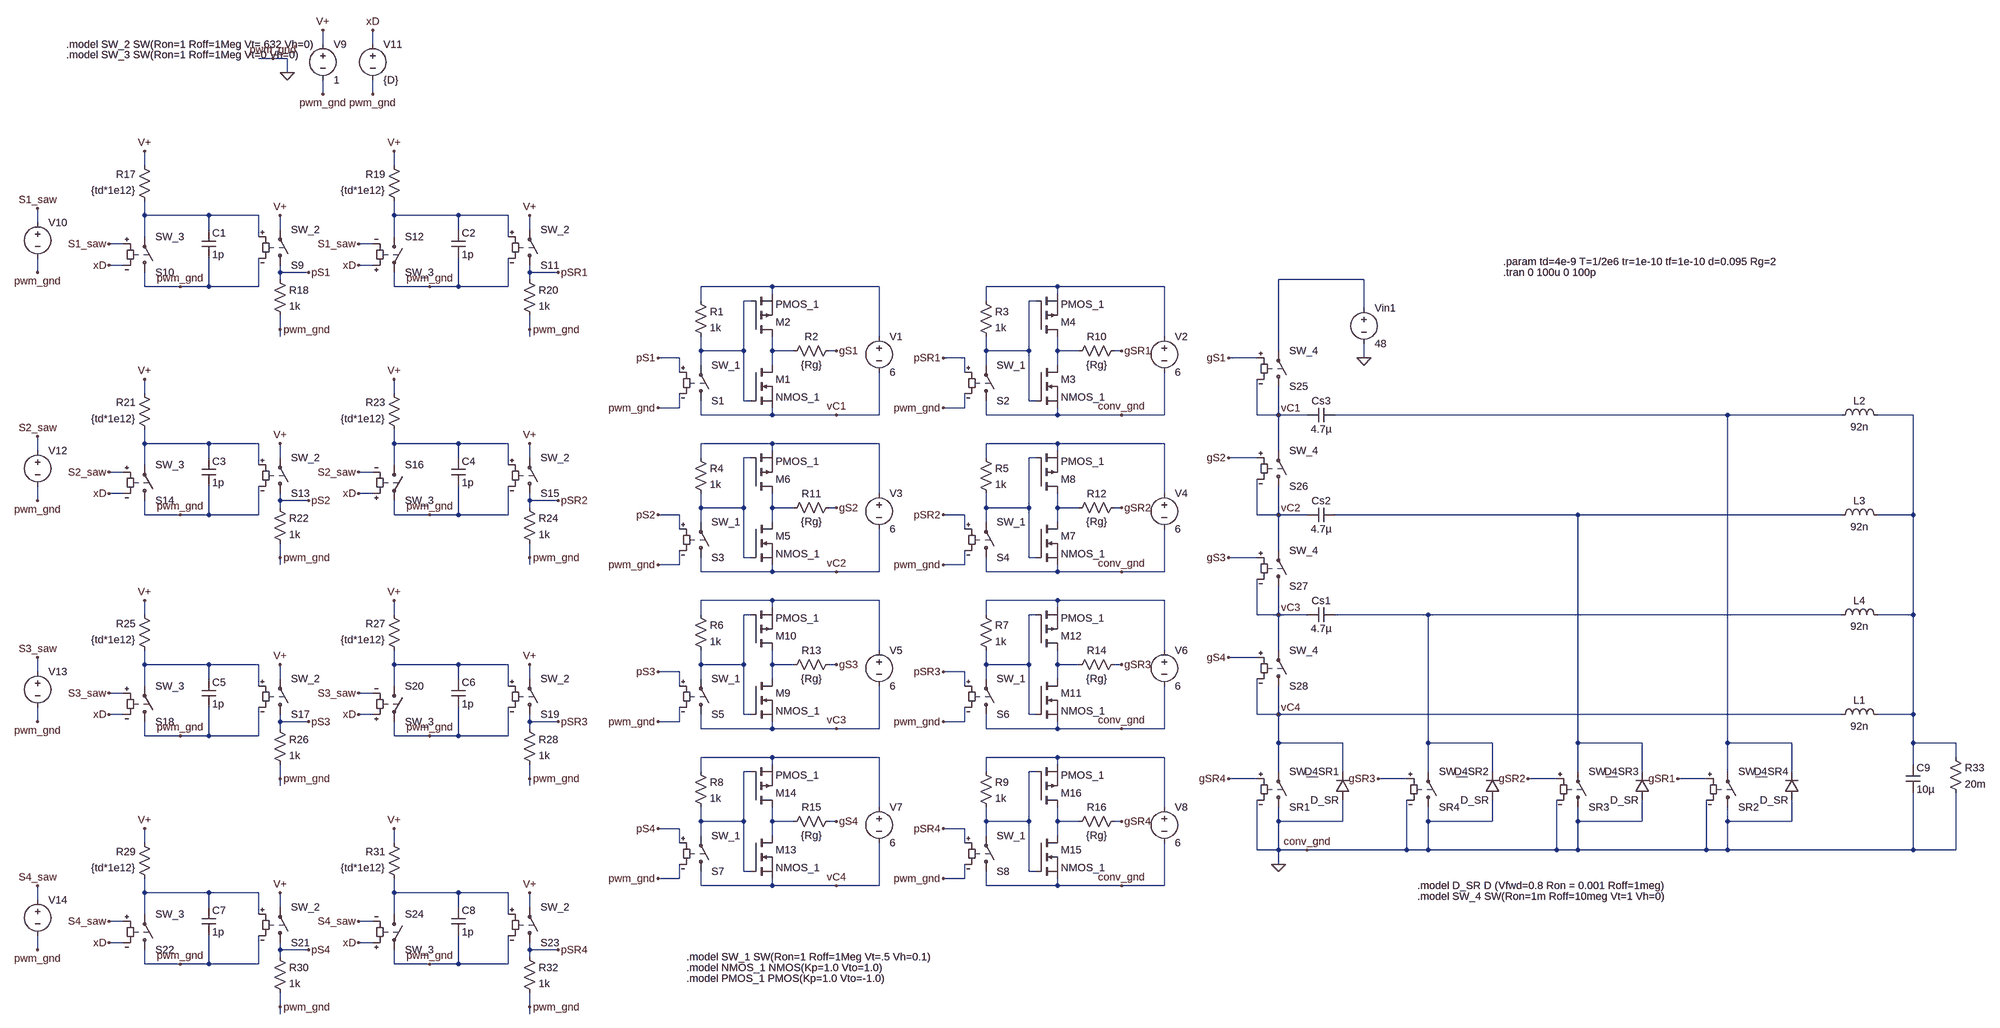
[diagram p0: schematic Draft5.asc]
Draft5.asc, the LTspice schematic file:
Version 4
SHEET 1 3272 1412
WIRE -448 -816 -448 -848
WIRE -336 -816 -336 -848
WIRE -560 -784 -592 -784
WIRE -528 -784 -560 -784
WIRE -528 -752 -528 -784
WIRE -448 -704 -448 -736
WIRE -336 -704 -336 -736
WIRE -848 -544 -848 -576
WIRE -288 -544 -288 -576
WIRE -848 -432 -848 -464
WIRE -704 -432 -848 -432
WIRE -592 -432 -704 -432
WIRE -288 -432 -288 -464
WIRE -144 -432 -288 -432
WIRE -32 -432 -144 -432
WIRE -1088 -416 -1088 -448
WIRE -704 -400 -704 -432
WIRE -544 -400 -544 -432
WIRE -144 -400 -144 -432
WIRE 16 -400 16 -432
WIRE -848 -384 -848 -432
WIRE -592 -384 -592 -432
WIRE -288 -384 -288 -432
WIRE -32 -384 -32 -432
WIRE -896 -368 -928 -368
WIRE -336 -368 -368 -368
WIRE -896 -320 -928 -320
WIRE -336 -320 -368 -320
WIRE -1088 -304 -1088 -336
WIRE -544 -304 -544 -320
WIRE -480 -304 -544 -304
WIRE 16 -304 16 -320
WIRE 80 -304 16 -304
WIRE -544 -288 -544 -304
WIRE 16 -288 16 -304
WIRE 1888 -288 1696 -288
WIRE -848 -272 -848 -304
WIRE -768 -272 -848 -272
WIRE -704 -272 -704 -336
WIRE -704 -272 -768 -272
WIRE -592 -272 -592 -336
WIRE -592 -272 -704 -272
WIRE -288 -272 -288 -304
WIRE -208 -272 -288 -272
WIRE -144 -272 -144 -336
WIRE -144 -272 -208 -272
WIRE -32 -272 -32 -336
WIRE -32 -272 -144 -272
WIRE 560 -272 400 -272
WIRE 800 -272 560 -272
WIRE 1200 -272 1040 -272
WIRE 1440 -272 1200 -272
WIRE 560 -256 560 -272
WIRE 1200 -256 1200 -272
WIRE 400 -240 400 -272
WIRE 512 -240 496 -240
WIRE 1040 -240 1040 -272
WIRE 1152 -240 1136 -240
WIRE 1888 -224 1888 -288
WIRE -544 -176 -544 -208
WIRE 16 -176 16 -208
WIRE -544 -160 -544 -176
WIRE 16 -160 16 -176
WIRE 800 -160 800 -272
WIRE 1440 -160 1440 -272
WIRE 400 -128 400 -160
WIRE 496 -128 496 -240
WIRE 496 -128 400 -128
WIRE 560 -128 560 -160
WIRE 608 -128 560 -128
WIRE 704 -128 688 -128
WIRE 1040 -128 1040 -160
WIRE 1136 -128 1136 -240
WIRE 1136 -128 1040 -128
WIRE 1200 -128 1200 -160
WIRE 1248 -128 1200 -128
WIRE 1344 -128 1328 -128
WIRE 1696 -128 1696 -288
WIRE 352 -112 304 -112
WIRE 992 -112 944 -112
WIRE 1648 -112 1584 -112
WIRE 1888 -112 1888 -144
WIRE 400 -96 400 -128
WIRE 560 -96 560 -128
WIRE 1040 -96 1040 -128
WIRE 1200 -96 1200 -128
WIRE 352 -80 352 -112
WIRE 992 -80 992 -112
WIRE -848 -32 -848 -64
WIRE -288 -32 -288 -64
WIRE 496 -16 496 -128
WIRE 512 -16 496 -16
WIRE 1136 -16 1136 -128
WIRE 1152 -16 1136 -16
WIRE 352 0 352 -32
WIRE 352 0 304 0
WIRE 992 0 992 -32
WIRE 992 0 944 0
WIRE 400 16 400 -16
WIRE 560 16 560 0
WIRE 560 16 400 16
WIRE 704 16 560 16
WIRE 800 16 800 -80
WIRE 800 16 704 16
WIRE 1040 16 1040 -16
WIRE 1200 16 1200 0
WIRE 1200 16 1040 16
WIRE 1344 16 1200 16
WIRE 1440 16 1440 -80
WIRE 1440 16 1344 16
WIRE 1648 16 1648 -64
WIRE 1696 16 1696 -48
WIRE 1696 16 1648 16
WIRE 1760 16 1696 16
WIRE 2704 16 1824 16
WIRE 2960 16 2704 16
WIRE 3120 16 3040 16
WIRE -848 80 -848 48
WIRE -704 80 -848 80
WIRE -592 80 -704 80
WIRE -288 80 -288 48
WIRE -144 80 -288 80
WIRE -32 80 -144 80
WIRE 560 80 400 80
WIRE 800 80 560 80
WIRE 1200 80 1040 80
WIRE 1440 80 1200 80
WIRE -1088 96 -1088 64
WIRE 560 96 560 80
WIRE 1200 96 1200 80
WIRE 1696 96 1696 16
WIRE -704 112 -704 80
WIRE -544 112 -544 80
WIRE -144 112 -144 80
WIRE 16 112 16 80
WIRE 400 112 400 80
WIRE 512 112 496 112
WIRE 1040 112 1040 80
WIRE 1152 112 1136 112
WIRE 1648 112 1584 112
WIRE -848 128 -848 80
WIRE -592 128 -592 80
WIRE -288 128 -288 80
WIRE -32 128 -32 80
WIRE -896 144 -928 144
WIRE -336 144 -368 144
WIRE -896 192 -928 192
WIRE -336 192 -368 192
WIRE 800 192 800 80
WIRE 1440 192 1440 80
WIRE -1088 208 -1088 176
WIRE -544 208 -544 192
WIRE -480 208 -544 208
WIRE 16 208 16 192
WIRE 80 208 16 208
WIRE -544 224 -544 208
WIRE 16 224 16 208
WIRE 400 224 400 192
WIRE 496 224 496 112
WIRE 496 224 400 224
WIRE 560 224 560 192
WIRE 608 224 560 224
WIRE 704 224 688 224
WIRE 1040 224 1040 192
WIRE 1136 224 1136 112
WIRE 1136 224 1040 224
WIRE 1200 224 1200 192
WIRE 1248 224 1200 224
WIRE 1344 224 1328 224
WIRE -848 240 -848 208
WIRE -768 240 -848 240
WIRE -704 240 -704 176
WIRE -704 240 -768 240
WIRE -592 240 -592 176
WIRE -592 240 -704 240
WIRE -288 240 -288 208
WIRE -208 240 -288 240
WIRE -144 240 -144 176
WIRE -144 240 -208 240
WIRE -32 240 -32 176
WIRE -32 240 -144 240
WIRE 352 240 304 240
WIRE 992 240 944 240
WIRE 1648 240 1648 160
WIRE 1696 240 1696 176
WIRE 1696 240 1648 240
WIRE 1760 240 1696 240
WIRE 2368 240 1824 240
WIRE 2960 240 2368 240
WIRE 3120 240 3120 16
WIRE 3120 240 3040 240
WIRE 400 256 400 224
WIRE 560 256 560 224
WIRE 1040 256 1040 224
WIRE 1200 256 1200 224
WIRE 352 272 352 240
WIRE 992 272 992 240
WIRE 1696 320 1696 240
WIRE -544 336 -544 304
WIRE 16 336 16 304
WIRE 496 336 496 224
WIRE 512 336 496 336
WIRE 1136 336 1136 224
WIRE 1152 336 1136 336
WIRE 1648 336 1584 336
WIRE -544 352 -544 336
WIRE 16 352 16 336
WIRE 352 352 352 320
WIRE 352 352 304 352
WIRE 992 352 992 320
WIRE 992 352 944 352
WIRE 400 368 400 336
WIRE 560 368 560 352
WIRE 560 368 400 368
WIRE 704 368 560 368
WIRE 800 368 800 272
WIRE 800 368 704 368
WIRE 1040 368 1040 336
WIRE 1200 368 1200 352
WIRE 1200 368 1040 368
WIRE 1344 368 1200 368
WIRE 1440 368 1440 272
WIRE 1440 368 1344 368
WIRE 560 432 400 432
WIRE 800 432 560 432
WIRE 1200 432 1040 432
WIRE 1440 432 1200 432
WIRE 560 448 560 432
WIRE 1200 448 1200 432
WIRE -848 464 -848 432
WIRE -288 464 -288 432
WIRE 400 464 400 432
WIRE 512 464 496 464
WIRE 1040 464 1040 432
WIRE 1152 464 1136 464
WIRE 1648 464 1648 384
WIRE 1696 464 1696 400
WIRE 1696 464 1648 464
WIRE 1760 464 1696 464
WIRE 2032 464 1824 464
WIRE 2960 464 2032 464
WIRE 3120 464 3120 240
WIRE 3120 464 3040 464
WIRE 800 544 800 432
WIRE 1440 544 1440 432
WIRE 1696 544 1696 464
WIRE 1648 560 1584 560
WIRE -848 576 -848 544
WIRE -704 576 -848 576
WIRE -592 576 -704 576
WIRE -288 576 -288 544
WIRE -144 576 -288 576
WIRE -32 576 -144 576
WIRE 400 576 400 544
WIRE 496 576 496 464
WIRE 496 576 400 576
WIRE 560 576 560 544
WIRE 608 576 560 576
WIRE 704 576 688 576
WIRE 1040 576 1040 544
WIRE 1136 576 1136 464
WIRE 1136 576 1040 576
WIRE 1200 576 1200 544
WIRE 1248 576 1200 576
WIRE 1344 576 1328 576
WIRE -1088 592 -1088 560
WIRE 352 592 304 592
WIRE 992 592 944 592
WIRE -704 608 -704 576
WIRE -544 608 -544 576
WIRE -144 608 -144 576
WIRE 16 608 16 576
WIRE 400 608 400 576
WIRE 560 608 560 576
WIRE 1040 608 1040 576
WIRE 1200 608 1200 576
WIRE -848 624 -848 576
WIRE -592 624 -592 576
WIRE -288 624 -288 576
WIRE -32 624 -32 576
WIRE 352 624 352 592
WIRE 992 624 992 592
WIRE -896 640 -928 640
WIRE -336 640 -368 640
WIRE -896 688 -928 688
WIRE -336 688 -368 688
WIRE 496 688 496 576
WIRE 512 688 496 688
WIRE 1136 688 1136 576
WIRE 1152 688 1136 688
WIRE 1648 688 1648 608
WIRE 1696 688 1696 624
WIRE 1696 688 1648 688
WIRE 2960 688 1696 688
WIRE 3120 688 3120 464
WIRE 3120 688 3040 688
WIRE -1088 704 -1088 672
WIRE -544 704 -544 688
WIRE -480 704 -544 704
WIRE 16 704 16 688
WIRE 80 704 16 704
WIRE 352 704 352 672
WIRE 352 704 304 704
WIRE 992 704 992 672
WIRE 992 704 944 704
WIRE -544 720 -544 704
WIRE 16 720 16 704
WIRE 400 720 400 688
WIRE 560 720 560 704
WIRE 560 720 400 720
WIRE 704 720 560 720
WIRE 800 720 800 624
WIRE 800 720 704 720
WIRE 1040 720 1040 688
WIRE 1200 720 1200 704
WIRE 1200 720 1040 720
WIRE 1344 720 1200 720
WIRE 1440 720 1440 624
WIRE 1440 720 1344 720
WIRE -848 736 -848 704
WIRE -768 736 -848 736
WIRE -704 736 -704 672
WIRE -704 736 -768 736
WIRE -592 736 -592 672
WIRE -592 736 -704 736
WIRE -288 736 -288 704
WIRE -208 736 -288 736
WIRE -144 736 -144 672
WIRE -144 736 -208 736
WIRE -32 736 -32 672
WIRE -32 736 -144 736
WIRE 1696 752 1696 688
WIRE 1840 752 1696 752
WIRE 2032 752 2032 464
WIRE 2176 752 2032 752
WIRE 2368 752 2368 240
WIRE 2512 752 2368 752
WIRE 2704 752 2704 16
WIRE 2848 752 2704 752
WIRE 3120 752 3120 688
WIRE 3216 752 3120 752
WIRE 560 784 400 784
WIRE 800 784 560 784
WIRE 1200 784 1040 784
WIRE 1440 784 1200 784
WIRE 3216 784 3216 752
WIRE 560 800 560 784
WIRE 1200 800 1200 784
WIRE 3120 800 3120 752
WIRE 400 816 400 784
WIRE 512 816 496 816
WIRE 1040 816 1040 784
WIRE 1152 816 1136 816
WIRE 1696 816 1696 752
WIRE 1840 816 1840 752
WIRE 2032 816 2032 752
WIRE 2176 816 2176 752
WIRE 2368 816 2368 752
WIRE 2512 816 2512 752
WIRE 2704 816 2704 752
WIRE 2848 816 2848 752
WIRE -544 832 -544 800
WIRE 16 832 16 800
WIRE 1648 832 1584 832
WIRE 1984 832 1920 832
WIRE 2320 832 2256 832
WIRE 2656 832 2592 832
WIRE -544 848 -544 832
WIRE 16 848 16 832
WIRE 800 896 800 784
WIRE 1440 896 1440 784
WIRE 400 928 400 896
WIRE 496 928 496 816
WIRE 496 928 400 928
WIRE 560 928 560 896
WIRE 608 928 560 928
WIRE 704 928 688 928
WIRE 1040 928 1040 896
WIRE 1136 928 1136 816
WIRE 1136 928 1040 928
WIRE 1200 928 1200 896
WIRE 1248 928 1200 928
WIRE 1344 928 1328 928
WIRE 1696 928 1696 896
WIRE 1840 928 1840 880
WIRE 1840 928 1696 928
WIRE 2032 928 2032 896
WIRE 2176 928 2176 880
WIRE 2176 928 2032 928
WIRE 2368 928 2368 896
WIRE 2512 928 2512 880
WIRE 2512 928 2368 928
WIRE 2704 928 2704 896
WIRE 2848 928 2848 880
WIRE 2848 928 2704 928
WIRE 352 944 304 944
WIRE 992 944 944 944
WIRE 400 960 400 928
WIRE 560 960 560 928
WIRE 1040 960 1040 928
WIRE 1200 960 1200 928
WIRE -848 976 -848 944
WIRE -288 976 -288 944
WIRE 352 976 352 944
WIRE 992 976 992 944
WIRE 1648 992 1648 880
WIRE 1696 992 1696 928
WIRE 1696 992 1648 992
WIRE 1760 992 1696 992
WIRE 1984 992 1984 880
WIRE 1984 992 1760 992
WIRE 2032 992 2032 928
WIRE 2032 992 1984 992
WIRE 2320 992 2320 880
WIRE 2320 992 2032 992
WIRE 2368 992 2368 928
WIRE 2368 992 2320 992
WIRE 2656 992 2656 880
WIRE 2656 992 2368 992
WIRE 2704 992 2704 928
WIRE 2704 992 2656 992
WIRE 3120 992 3120 864
WIRE 3120 992 2704 992
WIRE 3216 992 3216 864
WIRE 3216 992 3120 992
WIRE 1696 1024 1696 992
WIRE 496 1040 496 928
WIRE 512 1040 496 1040
WIRE 1136 1040 1136 928
WIRE 1152 1040 1136 1040
WIRE 352 1056 352 1024
WIRE 352 1056 304 1056
WIRE 992 1056 992 1024
WIRE 992 1056 944 1056
WIRE 400 1072 400 1040
WIRE 560 1072 560 1056
WIRE 560 1072 400 1072
WIRE 704 1072 560 1072
WIRE 800 1072 800 976
WIRE 800 1072 704 1072
WIRE 1040 1072 1040 1040
WIRE 1200 1072 1200 1056
WIRE 1200 1072 1040 1072
WIRE 1344 1072 1200 1072
WIRE 1440 1072 1440 976
WIRE 1440 1072 1344 1072
WIRE -848 1088 -848 1056
WIRE -704 1088 -848 1088
WIRE -592 1088 -704 1088
WIRE -288 1088 -288 1056
WIRE -144 1088 -288 1088
WIRE -32 1088 -144 1088
WIRE -1088 1104 -1088 1072
WIRE -704 1120 -704 1088
WIRE -544 1120 -544 1088
WIRE -144 1120 -144 1088
WIRE 16 1120 16 1088
WIRE -848 1136 -848 1088
WIRE -592 1136 -592 1088
WIRE -288 1136 -288 1088
WIRE -32 1136 -32 1088
WIRE -896 1152 -928 1152
WIRE -336 1152 -368 1152
WIRE -896 1200 -928 1200
WIRE -336 1200 -368 1200
WIRE -1088 1216 -1088 1184
WIRE -544 1216 -544 1200
WIRE -480 1216 -544 1216
WIRE 16 1216 16 1200
WIRE 80 1216 16 1216
WIRE -544 1232 -544 1216
WIRE 16 1232 16 1216
WIRE -848 1248 -848 1216
WIRE -768 1248 -848 1248
WIRE -704 1248 -704 1184
WIRE -704 1248 -768 1248
WIRE -592 1248 -592 1184
WIRE -592 1248 -704 1248
WIRE -288 1248 -288 1216
WIRE -208 1248 -288 1248
WIRE -144 1248 -144 1184
WIRE -144 1248 -208 1248
WIRE -32 1248 -32 1184
WIRE -32 1248 -144 1248
WIRE -544 1344 -544 1312
WIRE 16 1344 16 1312
WIRE -544 1360 -544 1344
WIRE 16 1360 16 1344
FLAG 304 -112 pS1
FLAG 304 240 pS2
FLAG 304 592 pS3
FLAG 304 944 pS4
FLAG 944 -112 pSR1
FLAG 944 240 pSR2
FLAG 944 592 pSR3
FLAG 944 944 pSR4
FLAG 304 0 pwm_gnd
FLAG 304 352 pwm_gnd
FLAG 304 704 pwm_gnd
FLAG 304 1056 pwm_gnd
FLAG 944 0 pwm_gnd
FLAG 944 352 pwm_gnd
FLAG 944 704 pwm_gnd
FLAG 944 1056 pwm_gnd
FLAG 1344 16 conv_gnd
FLAG 1344 368 conv_gnd
FLAG 1344 720 conv_gnd
FLAG 1344 1072 conv_gnd
FLAG 704 16 vC1
FLAG 704 368 vC2
FLAG 704 720 vC3
FLAG 704 1072 vC4
FLAG 704 -128 gS1
FLAG 704 224 gS2
FLAG 704 576 gS3
FLAG 704 928 gS4
FLAG 1344 -128 gSR1
FLAG 1344 224 gSR2
FLAG 1344 576 gSR3
FLAG 1344 928 gSR4
FLAG -480 -304 pS1
FLAG -448 -848 V+
FLAG -848 -576 V+
FLAG -448 -704 pwm_gnd
FLAG -544 -176 pwm_gnd
FLAG -768 -272 pwm_gnd
FLAG -336 -704 pwm_gnd
FLAG -1088 -304 pwm_gnd
FLAG -336 -848 xD
FLAG -928 -320 xD
FLAG -544 -432 V+
FLAG -528 -752 0
FLAG -560 -784 pwm_gnd
FLAG 80 -304 pSR1
FLAG -288 -576 V+
FLAG 16 -176 pwm_gnd
FLAG -208 -272 pwm_gnd
FLAG -368 -320 xD
FLAG 16 -432 V+
FLAG -1088 -448 S1_saw
FLAG -928 -368 S1_saw
FLAG -368 -368 S1_saw
FLAG -480 208 pS2
FLAG -848 -64 V+
FLAG -544 336 pwm_gnd
FLAG -768 240 pwm_gnd
FLAG -1088 208 pwm_gnd
FLAG -928 192 xD
FLAG -544 80 V+
FLAG 80 208 pSR2
FLAG -288 -64 V+
FLAG 16 336 pwm_gnd
FLAG -208 240 pwm_gnd
FLAG -368 192 xD
FLAG 16 80 V+
FLAG -1088 64 S2_saw
FLAG -480 704 pS3
FLAG -848 432 V+
FLAG -544 832 pwm_gnd
FLAG -768 736 pwm_gnd
FLAG -1088 704 pwm_gnd
FLAG -928 688 xD
FLAG -544 576 V+
FLAG 80 704 pSR3
FLAG -288 432 V+
FLAG 16 832 pwm_gnd
FLAG -208 736 pwm_gnd
FLAG -368 688 xD
FLAG 16 576 V+
FLAG -1088 560 S3_saw
FLAG -480 1216 pS4
FLAG -848 944 V+
FLAG -544 1344 pwm_gnd
FLAG -768 1248 pwm_gnd
FLAG -1088 1216 pwm_gnd
FLAG -928 1200 xD
FLAG -544 1088 V+
FLAG 80 1216 pSR4
FLAG -288 944 V+
FLAG 16 1344 pwm_gnd
FLAG -208 1248 pwm_gnd
FLAG -368 1200 xD
FLAG 16 1088 V+
FLAG -1088 1072 S4_saw
FLAG -928 144 S2_saw
FLAG -368 144 S2_saw
FLAG -928 640 S3_saw
FLAG -368 640 S3_saw
FLAG -928 1152 S4_saw
FLAG -368 1152 S4_saw
FLAG 1888 -112 0
FLAG 1696 1024 0
FLAG 1584 -112 gS1
FLAG 1584 112 gS2
FLAG 1584 336 gS3
FLAG 1584 560 gS4
FLAG 2592 832 gSR1
FLAG 2256 832 gSR2
FLAG 1920 832 gSR3
FLAG 1584 832 gSR4
FLAG 1696 688 vC4
FLAG 1696 464 vC3
FLAG 1696 240 vC2
FLAG 1696 16 vC1
FLAG 1760 992 conv_gnd
SYMBOL nmos 512 -96 R0
SYMATTR InstName M1
SYMATTR Value NMOS_1
SYMBOL pmos 512 -160 M180
SYMATTR InstName M2
SYMATTR Value PMOS_1
SYMBOL res 384 -256 R0
SYMATTR InstName R1
SYMATTR Value 1k
SYMBOL sw 400 0 M180
SYMATTR InstName S1
SYMATTR Value SW_1
SYMBOL voltage 800 -176 R0
WINDOW 123 0 0 Left 0
WINDOW 39 0 0 Left 0
SYMATTR InstName V1
SYMATTR Value 6
SYMBOL res 704 -144 R90
WINDOW 0 0 56 VBottom 2
WINDOW 3 32 56 VTop 2
SYMATTR InstName R2
SYMATTR Value {Rg}
SYMBOL nmos 1152 -96 R0
SYMATTR InstName M3
SYMATTR Value NMOS_1
SYMBOL pmos 1152 -160 M180
SYMATTR InstName M4
SYMATTR Value PMOS_1
SYMBOL res 1024 -256 R0
SYMATTR InstName R3
SYMATTR Value 1k
SYMBOL sw 1040 0 M180
SYMATTR InstName S2
SYMATTR Value SW_1
SYMBOL voltage 1440 -176 R0
WINDOW 123 0 0 Left 0
WINDOW 39 0 0 Left 0
SYMATTR InstName V2
SYMATTR Value 6
SYMBOL nmos 512 256 R0
SYMATTR InstName M5
SYMATTR Value NMOS_1
SYMBOL pmos 512 192 M180
SYMATTR InstName M6
SYMATTR Value PMOS_1
SYMBOL res 384 96 R0
SYMATTR InstName R4
SYMATTR Value 1k
SYMBOL sw 400 352 M180
SYMATTR InstName S3
SYMATTR Value SW_1
SYMBOL voltage 800 176 R0
WINDOW 123 0 0 Left 0
WINDOW 39 0 0 Left 0
SYMATTR InstName V3
SYMATTR Value 6
SYMBOL nmos 1152 256 R0
SYMATTR InstName M7
SYMATTR Value NMOS_1
SYMBOL pmos 1152 192 M180
SYMATTR InstName M8
SYMATTR Value PMOS_1
SYMBOL res 1024 96 R0
SYMATTR InstName R5
SYMATTR Value 1k
SYMBOL sw 1040 352 M180
SYMATTR InstName S4
SYMATTR Value SW_1
SYMBOL voltage 1440 176 R0
WINDOW 123 0 0 Left 0
WINDOW 39 0 0 Left 0
SYMATTR InstName V4
SYMATTR Value 6
SYMBOL nmos 512 608 R0
SYMATTR InstName M9
SYMATTR Value NMOS_1
SYMBOL pmos 512 544 M180
SYMATTR InstName M10
SYMATTR Value PMOS_1
SYMBOL res 384 448 R0
SYMATTR InstName R6
SYMATTR Value 1k
SYMBOL sw 400 704 M180
SYMATTR InstName S5
SYMATTR Value SW_1
SYMBOL voltage 800 528 R0
WINDOW 123 0 0 Left 0
WINDOW 39 0 0 Left 0
SYMATTR InstName V5
SYMATTR Value 6
SYMBOL nmos 1152 608 R0
SYMATTR InstName M11
SYMATTR Value NMOS_1
SYMBOL pmos 1152 544 M180
SYMATTR InstName M12
SYMATTR Value PMOS_1
SYMBOL res 1024 448 R0
SYMATTR InstName R7
SYMATTR Value 1k
SYMBOL sw 1040 704 M180
SYMATTR InstName S6
SYMATTR Value SW_1
SYMBOL voltage 1440 528 R0
WINDOW 123 0 0 Left 0
WINDOW 39 0 0 Left 0
SYMATTR InstName V6
SYMATTR Value 6
SYMBOL nmos 512 960 R0
SYMATTR InstName M13
SYMATTR Value NMOS_1
SYMBOL pmos 512 896 M180
SYMATTR InstName M14
SYMATTR Value PMOS_1
SYMBOL res 384 800 R0
SYMATTR InstName R8
SYMATTR Value 1k
SYMBOL sw 400 1056 M180
SYMATTR InstName S7
SYMATTR Value SW_1
SYMBOL voltage 800 880 R0
WINDOW 123 0 0 Left 0
WINDOW 39 0 0 Left 0
SYMATTR InstName V7
SYMATTR Value 6
SYMBOL nmos 1152 960 R0
SYMATTR InstName M15
SYMATTR Value NMOS_1
SYMBOL pmos 1152 896 M180
SYMATTR InstName M16
SYMATTR Value PMOS_1
SYMBOL res 1024 800 R0
SYMATTR InstName R9
SYMATTR Value 1k
SYMBOL sw 1040 1056 M180
SYMATTR InstName S8
SYMATTR Value SW_1
SYMBOL voltage 1440 880 R0
WINDOW 123 0 0 Left 0
WINDOW 39 0 0 Left 0
SYMATTR InstName V8
SYMATTR Value 6
SYMBOL res 1344 -144 R90
WINDOW 0 0 56 VBottom 2
WINDOW 3 32 56 VTop 2
SYMATTR InstName R10
SYMATTR Value {Rg}
SYMBOL res 704 208 R90
WINDOW 0 0 56 VBottom 2
WINDOW 3 32 56 VTop 2
SYMATTR InstName R11
SYMATTR Value {Rg}
SYMBOL res 1344 208 R90
WINDOW 0 0 56 VBottom 2
WINDOW 3 32 56 VTop 2
SYMATTR InstName R12
SYMATTR Value {Rg}
SYMBOL res 704 560 R90
WINDOW 0 0 56 VBottom 2
WINDOW 3 32 56 VTop 2
SYMATTR InstName R13
SYMATTR Value {Rg}
SYMBOL res 1344 560 R90
WINDOW 0 0 56 VBottom 2
WINDOW 3 32 56 VTop 2
SYMATTR InstName R14
SYMATTR Value {Rg}
SYMBOL res 704 912 R90
WINDOW 0 0 56 VBottom 2
WINDOW 3 32 56 VTop 2
SYMATTR InstName R15
SYMATTR Value {Rg}
SYMBOL res 1344 912 R90
WINDOW 0 0 56 VBottom 2
WINDOW 3 32 56 VTop 2
SYMATTR InstName R16
SYMATTR Value {Rg}
SYMBOL res -832 -448 R180
WINDOW 0 36 76 Left 2
WINDOW 3 36 40 Left 2
SYMATTR InstName R17
SYMATTR Value {td*1e12}
SYMBOL cap -720 -400 R0
SYMATTR InstName C1
SYMATTR Value 1p
SYMBOL sw -544 -304 M180
SYMATTR InstName S9
SYMATTR Value SW_2
SYMBOL res -560 -304 R0
SYMATTR InstName R18
SYMATTR Value 1k
SYMBOL voltage -448 -832 R0
WINDOW 123 0 0 Left 0
WINDOW 39 0 0 Left 0
SYMATTR InstName V9
SYMATTR Value 1
SYMBOL voltage -1088 -432 R0
WINDOW 3 24 96 Invisible 2
WINDOW 123 0 0 Left 0
WINDOW 39 0 0 Left 0
SYMATTR Value PULSE(0 1 0 {T} 0 10p {T})
SYMATTR InstName V10
SYMBOL sw -848 -288 M180
SYMATTR InstName S10
SYMATTR Value SW_3
SYMBOL voltage -336 -832 R0
WINDOW 123 0 0 Left 0
WINDOW 39 0 0 Left 0
SYMATTR InstName V11
SYMATTR Value {D}
SYMBOL res -272 -448 R180
WINDOW 0 36 76 Left 2
WINDOW 3 36 40 Left 2
SYMATTR InstName R19
SYMATTR Value {td*1e12}
SYMBOL cap -160 -400 R0
SYMATTR InstName C2
SYMATTR Value 1p
SYMBOL sw 16 -304 M180
SYMATTR InstName S11
SYMATTR Value SW_2
SYMBOL res 0 -304 R0
SYMATTR InstName R20
SYMATTR Value 1k
SYMBOL sw -288 -400 R0
SYMATTR InstName S12
SYMATTR Value SW_3
SYMBOL res -832 64 R180
WINDOW 0 36 76 Left 2
WINDOW 3 36 40 Left 2
SYMATTR InstName R21
SYMATTR Value {td*1e12}
SYMBOL cap -720 112 R0
SYMATTR InstName C3
SYMATTR Value 1p
SYMBOL sw -544 208 M180
SYMATTR InstName S13
SYMATTR Value SW_2
SYMBOL res -560 208 R0
SYMATTR InstName R22
SYMATTR Value 1k
SYMBOL voltage -1088 80 R0
WINDOW 3 24 96 Invisible 2
WINDOW 123 0 0 Left 0
WINDOW 39 0 0 Left 0
SYMATTR Value PULSE(0 1 {T/4} {T} 0 10p {T})
SYMATTR InstName V12
SYMBOL sw -848 224 M180
SYMATTR InstName S14
SYMATTR Value SW_3
SYMBOL res -272 64 R180
WINDOW 0 36 76 Left 2
WINDOW 3 36 40 Left 2
SYMATTR InstName R23
SYMATTR Value {td*1e12}
SYMBOL cap -160 112 R0
SYMATTR InstName C4
SYMATTR Value 1p
SYMBOL sw 16 208 M180
SYMATTR InstName S15
SYMATTR Value SW_2
SYMBOL res 0 208 R0
SYMATTR InstName R24
SYMATTR Value 1k
SYMBOL sw -288 112 R0
SYMATTR InstName S16
SYMATTR Value SW_3
SYMBOL res -832 560 R180
WINDOW 0 36 76 Left 2
WINDOW 3 36 40 Left 2
SYMATTR InstName R25
SYMATTR Value {td*1e12}
SYMBOL cap -720 608 R0
SYMATTR InstName C5
SYMATTR Value 1p
SYMBOL sw -544 704 M180
SYMATTR InstName S17
SYMATTR Value SW_2
SYMBOL res -560 704 R0
SYMATTR InstName R26
SYMATTR Value 1k
SYMBOL voltage -1088 576 R0
WINDOW 3 24 96 Invisible 2
WINDOW 123 0 0 Left 0
WINDOW 39 0 0 Left 0
SYMATTR Value PULSE(0 1 {2*T/4} {T} 0 10p {T})
SYMATTR InstName V13
SYMBOL sw -848 720 M180
SYMATTR InstName S18
SYMATTR Value SW_3
SYMBOL res -272 560 R180
WINDOW 0 36 76 Left 2
WINDOW 3 36 40 Left 2
SYMATTR InstName R27
SYMATTR Value {td*1e12}
SYMBOL cap -160 608 R0
SYMATTR InstName C6
SYMATTR Value 1p
SYMBOL sw 16 704 M180
SYMATTR InstName S19
SYMATTR Value SW_2
SYMBOL res 0 704 R0
SYMATTR InstName R28
SYMATTR Value 1k
SYMBOL sw -288 608 R0
SYMATTR InstName S20
SYMATTR Value SW_3
SYMBOL res -832 1072 R180
WINDOW 0 36 76 Left 2
WINDOW 3 36 40 Left 2
SYMATTR InstName R29
SYMATTR Value {td*1e12}
SYMBOL cap -720 1120 R0
SYMATTR InstName C7
SYMATTR Value 1p
SYMBOL sw -544 1216 M180
SYMATTR InstName S21
SYMATTR Value SW_2
SYMBOL res -560 1216 R0
SYMATTR InstName R30
SYMATTR Value 1k
SYMBOL voltage -1088 1088 R0
WINDOW 3 24 96 Invisible 2
WINDOW 123 0 0 Left 0
WINDOW 39 0 0 Left 0
SYMATTR Value PULSE(0 1 {3*T/4} {T} 0 10p {T})
SYMATTR InstName V14
SYMBOL sw -848 1232 M180
SYMATTR InstName S22
SYMATTR Value SW_3
SYMBOL res -272 1072 R180
WINDOW 0 36 76 Left 2
WINDOW 3 36 40 Left 2
SYMATTR InstName R31
SYMATTR Value {td*1e12}
SYMBOL cap -160 1120 R0
SYMATTR InstName C8
SYMATTR Value 1p
SYMBOL sw 16 1216 M180
SYMATTR InstName S23
SYMATTR Value SW_2
SYMBOL res 0 1216 R0
SYMATTR InstName R32
SYMATTR Value 1k
SYMBOL sw -288 1120 R0
SYMATTR InstName S24
SYMATTR Value SW_3
SYMBOL voltage 1888 -240 R0
WINDOW 123 0 0 Left 0
WINDOW 39 0 0 Left 0
SYMATTR InstName Vin1
SYMATTR Value 48
SYMBOL cap 3104 800 R0
SYMATTR InstName C9
SYMATTR Value 10µ
SYMATTR SpiceLine Rser=3m
SYMATTR SpiceLine2 IC = 1
SYMBOL cap 1824 448 R90
WINDOW 0 0 32 VBottom 2
WINDOW 3 32 32 VTop 2
SYMATTR InstName Cs1
SYMATTR Value 4.7µ
SYMATTR SpiceLine Rser=4m
SYMBOL ind 2944 704 R270
WINDOW 0 32 56 VTop 2
WINDOW 3 5 56 VBottom 2
SYMATTR InstName L1
SYMATTR Value 92n
SYMATTR SpiceLine Rser=2.6m
SYMBOL res 3200 768 R0
SYMATTR InstName R33
SYMATTR Value 20m
SYMBOL diode 1856 880 R180
WINDOW 0 24 64 Left 2
WINDOW 3 24 0 Left 2
SYMATTR InstName D_SR1
SYMATTR Value D_SR
SYMBOL cap 1824 224 R90
WINDOW 0 0 32 VBottom 2
WINDOW 3 32 32 VTop 2
SYMATTR InstName Cs2
SYMATTR Value 4.7µ
SYMATTR SpiceLine Rser=4m
SYMBOL cap 1824 0 R90
WINDOW 0 0 32 VBottom 2
WINDOW 3 32 32 VTop 2
SYMATTR InstName Cs3
SYMATTR Value 4.7µ
SYMATTR SpiceLine Rser=4m
SYMBOL ind 2944 32 R270
WINDOW 0 32 56 VTop 2
WINDOW 3 5 56 VBottom 2
SYMATTR InstName L2
SYMATTR Value 92n
SYMATTR SpiceLine Rser=2.6m
SYMBOL ind 2944 256 R270
WINDOW 0 32 56 VTop 2
WINDOW 3 5 56 VBottom 2
SYMATTR InstName L3
SYMATTR Value 92n
SYMATTR SpiceLine Rser=2.6m
SYMBOL ind 2944 480 R270
WINDOW 0 32 56 VTop 2
WINDOW 3 5 56 VBottom 2
SYMATTR InstName L4
SYMATTR Value 92n
SYMATTR SpiceLine Rser=2.6m
SYMBOL diode 2192 880 R180
WINDOW 0 24 64 Left 2
WINDOW 3 24 0 Left 2
SYMATTR InstName D_SR2
SYMATTR Value D_SR
SYMBOL diode 2528 880 R180
WINDOW 0 24 64 Left 2
WINDOW 3 24 0 Left 2
SYMATTR InstName D_SR3
SYMATTR Value D_SR
SYMBOL diode 2864 880 R180
WINDOW 0 24 64 Left 2
WINDOW 3 24 0 Left 2
SYMATTR InstName D_SR4
SYMATTR Value D_SR
SYMBOL sw 1696 -32 M180
SYMATTR InstName S25
SYMATTR Value SW_4
SYMBOL sw 1696 192 M180
SYMATTR InstName S26
SYMATTR Value SW_4
SYMBOL sw 1696 416 M180
SYMATTR InstName S27
SYMATTR Value SW_4
SYMBOL sw 1696 640 M180
SYMATTR InstName S28
SYMATTR Value SW_4
SYMBOL sw 1696 912 M180
SYMATTR InstName SR1
SYMATTR Value SW_4
SYMBOL sw 2704 912 M180
SYMATTR InstName SR2
SYMATTR Value SW_4
SYMBOL sw 2368 912 M180
SYMATTR InstName SR3
SYMATTR Value SW_4
SYMBOL sw 2032 912 M180
SYMATTR InstName SR4
SYMATTR Value SW_4
TEXT -1024 -816 Left 2 !.model SW_2 SW(Ron=1 Roff=1Meg Vt=.632 Vh=0)
TEXT -1024 -792 Left 2 !.model SW_3 SW(Ron=1 Roff=1Meg Vt=0 Vh=0)
TEXT 368 1232 Left 2 !.model SW_1 SW(Ron=1 Roff=1Meg Vt=.5 Vh=0.1)
TEXT 368 1256 Left 2 !.model NMOS_1 NMOS(Kp=1.0 Vto=1.0)
TEXT 368 1280 Left 2 !.model PMOS_1 PMOS(Kp=1.0 Vto=-1.0)
TEXT 2200 -328 Left 2 !.param td=4e-9 T=1/2e6 tr=1e-10 tf=1e-10 d=0.095 Rg=2
TEXT 2200 -304 Left 2 !.tran 0 100u 0 100p
TEXT 2008 1072 Left 2 !.model D_SR D (Vfwd=0.8 Ron = 0.001 Roff=1meg)
TEXT 2008 1096 Left 2 !.model SW_4 SW(Ron=1m Roff=10meg Vt=1 Vh=0)

The netlist it stands for:
* Draft5.asc
M1 N008 N006 vC1 vC1 NMOS_1
M2 N008 N006 N004 N004 PMOS_1
R1 N004 N006 1k
S1 vC1 N006 pS1 0 SW_1
V1 N004 vC1 6
R2 gS1 N008 {Rg}
M3 N009 N007 0 0 NMOS_1
M4 N009 N007 N005 N005 PMOS_1
R3 N005 N007 1k
S2 0 N007 pSR1 0 SW_1
V2 N005 0 6
M5 N018 N016 vC2 vC2 NMOS_1
M6 N018 N016 N014 N014 PMOS_1
R4 N014 N016 1k
S3 vC2 N016 pS2 0 SW_1
V3 N014 vC2 6
M7 N019 N017 0 0 NMOS_1
M8 N019 N017 N015 N015 PMOS_1
R5 N015 N017 1k
S4 0 N017 pSR2 0 SW_1
V4 N015 0 6
M9 N028 N023 vC3 vC3 NMOS_1
M10 N028 N023 N021 N021 PMOS_1
R6 N021 N023 1k
S5 vC3 N023 pS3 0 SW_1
V5 N021 vC3 6
M11 N029 N024 0 0 NMOS_1
M12 N029 N024 N022 N022 PMOS_1
R7 N022 N024 1k
S6 0 N024 pSR3 0 SW_1
V6 N022 0 6
M13 N034 N032 vC4 vC4 NMOS_1
M14 N034 N032 N030 N030 PMOS_1
R8 N030 N032 1k
S7 vC4 N032 pS4 0 SW_1
V7 N030 vC4 6
M15 N035 N033 0 0 NMOS_1
M16 N035 N033 N031 N031 PMOS_1
R9 N031 N033 1k
S8 0 N033 pSR4 0 SW_1
V8 N031 0 6
R10 gSR1 N009 {Rg}
R11 gS2 N018 {Rg}
R12 gSR2 N019 {Rg}
R13 gS3 N028 {Rg}
R14 gSR3 N029 {Rg}
R15 gS4 N034 {Rg}
R16 gSR4 N035 {Rg}
R17 N001 V+ {td*1e12}
C1 N001 0 1p
S9 pS1 V+ N001 0 SW_2
R18 pS1 0 1k
V9 V+ 0 1
V10 S1_saw 0 PULSE(0 1 0 {T} 0 10p {T})
S10 0 N001 S1_saw xD SW_3
V11 xD 0 {D}
R19 N002 V+ {td*1e12}
C2 N002 0 1p
S11 pSR1 V+ N002 0 SW_2
R20 pSR1 0 1k
S12 N002 0 xD S1_saw SW_3
R21 N012 V+ {td*1e12}
C3 N012 0 1p
S13 pS2 V+ N012 0 SW_2
R22 pS2 0 1k
V12 S2_saw 0 PULSE(0 1 {T/4} {T} 0 10p {T})
S14 0 N012 S2_saw xD SW_3
R23 N013 V+ {td*1e12}
C4 N013 0 1p
S15 pSR2 V+ N013 0 SW_2
R24 pSR2 0 1k
S16 N013 0 xD S2_saw SW_3
R25 N026 V+ {td*1e12}
C5 N026 0 1p
S17 pS3 V+ N026 0 SW_2
R26 pS3 0 1k
V13 S3_saw 0 PULSE(0 1 {2*T/4} {T} 0 10p {T})
S18 0 N026 S3_saw xD SW_3
R27 N027 V+ {td*1e12}
C6 N027 0 1p
S19 pSR3 V+ N027 0 SW_2
R28 pSR3 0 1k
S20 N027 0 xD S3_saw SW_3
R29 N036 V+ {td*1e12}
C7 N036 0 1p
S21 pS4 V+ N036 0 SW_2
R30 pS4 0 1k
V14 S4_saw 0 PULSE(0 1 {3*T/4} {T} 0 10p {T})
S22 0 N036 S4_saw xD SW_3
R31 N037 V+ {td*1e12}
C8 N037 0 1p
S23 pSR4 V+ N037 0 SW_2
R32 pSR4 0 1k
S24 N037 0 xD S4_saw SW_3
Vin1 N003 0 48
C9 N011 0 10µ Rser=3m IC = 1
Cs1 N025 vC3 4.7µ Rser=4m
L1 vC4 N011 92n Rser=2.6m
R33 N011 0 20m
D_SR1 0 vC4 D_SR
Cs2 N020 vC2 4.7µ Rser=4m
Cs3 N010 vC1 4.7µ Rser=4m
L2 N010 N011 92n Rser=2.6m
L3 N020 N011 92n Rser=2.6m
L4 N025 N011 92n Rser=2.6m
D_SR2 0 N025 D_SR
D_SR3 0 N020 D_SR
D_SR4 0 N010 D_SR
S25 vC1 N003 gS1 vC1 SW_4
S26 vC2 vC1 gS2 vC2 SW_4
S27 vC3 vC2 gS3 vC3 SW_4
S28 vC4 vC3 gS4 vC4 SW_4
SR1 0 vC4 gSR4 0 SW_4
SR2 0 N010 gSR1 0 SW_4
SR3 0 N020 gSR2 0 SW_4
SR4 0 N025 gSR3 0 SW_4
.model D D
.lib standard.dio
.model NMOS NMOS
.model PMOS PMOS
.lib standard.mos
.model SW_2 SW(Ron=1 Roff=1Meg Vt=.632 Vh=0)
.model SW_3 SW(Ron=1 Roff=1Meg Vt=0 Vh=0)
.model SW_1 SW(Ron=1 Roff=1Meg Vt=.5 Vh=0.1)
.model NMOS_1 NMOS(Kp=1.0 Vto=1.0)
.model PMOS_1 PMOS(Kp=1.0 Vto=-1.0)
.param td=4e-9 T=1/2e6 tr=1e-10 tf=1e-10 d=0.095 Rg=2
.tran 0 100u 0 100p
.model D_SR D (Vfwd=0.8 Ron = 0.001 Roff=1meg)
.model SW_4 SW(Ron=1m Roff=10meg Vt=1 Vh=0)
.backanno
.end